# EAGLE design tactBell_revA (EAGLE 8.4.0)
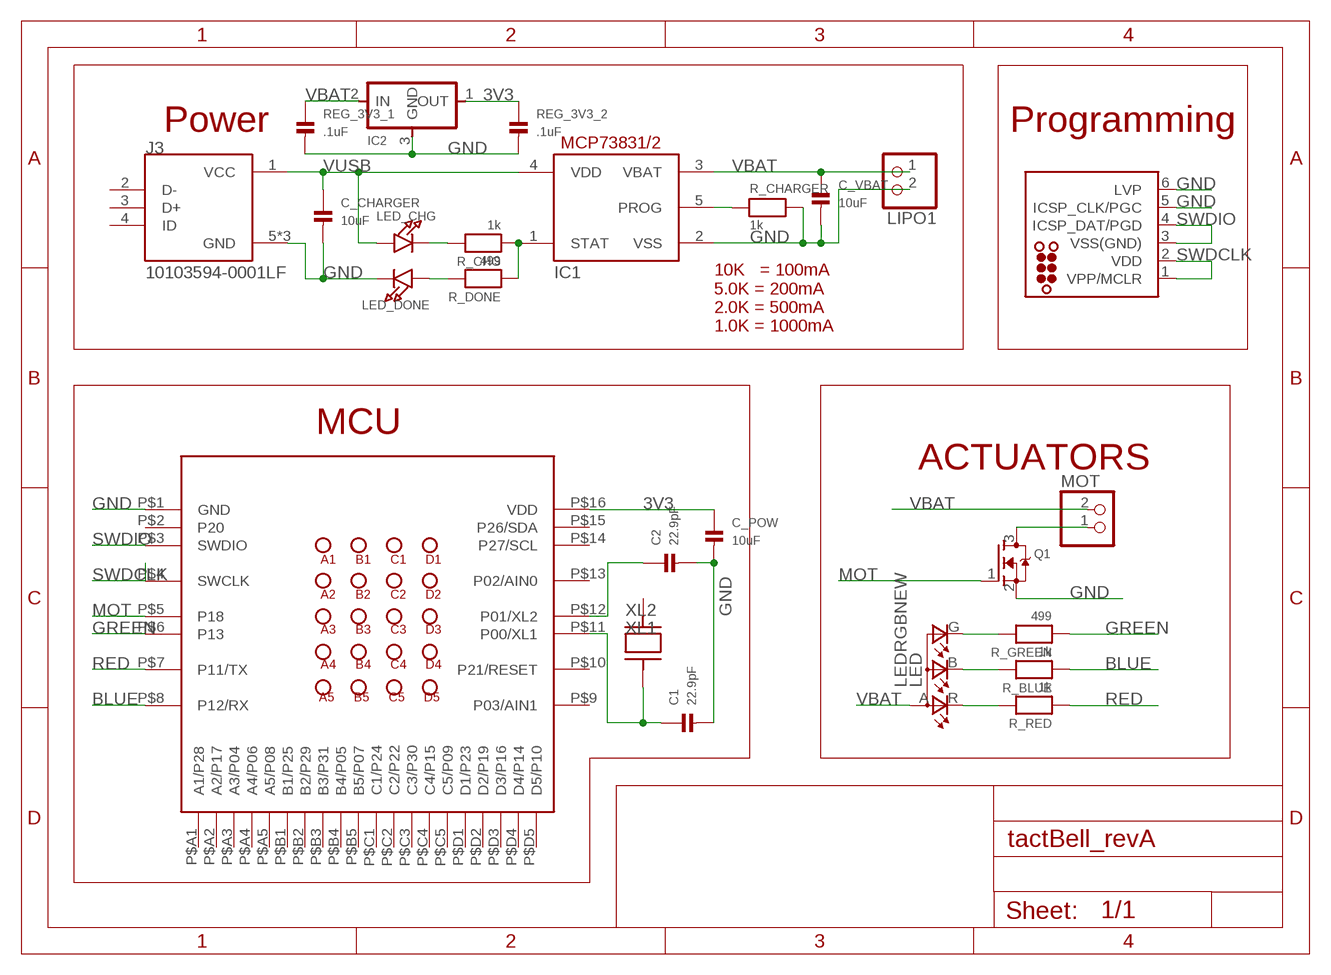
[diagram p0: schematic, sheet 1]

## Parts
C1  22.9pF  CAP_CERAMIC0603  [0603]
C2  22.9pF  CAP_CERAMIC0603  [0603]
C_CHARGER  10uF  CAP_CERAMIC0603  [0603]
C_POW  10uF  CAP_CERAMIC0603  [0603]
C_VBAT  10uF  CAP_CERAMIC0603  [0603]
IC1  MCP73831/OT  [SOT23-5L]
IC2  REGULATORSOT23  [SOT23]
J1  TC2030-MCP-NL  [TC2030-MCP-NL]
J3  10103594-0001LF  [FCI_10103594-0001LF]
LED  LEDRGBNEW  [P-LCC-4]
LED_CHG  LED0603  [CHIPLED_0603]
LED_DONE  LED0603  [CHIPLED_0603]
LIPO1  JST_2PIN-SMT-RA  [JST-PH-2-SMT-RA]
MOT  JST_2PIN-SMT-RA  [JST-PH-2-SMT-RA]
Q1  MOSFET-NREFLOW  [SOT23-R]
R_BLUE  1k  RESISTOR0603  [0603]
R_CHARGER  1k  RESISTOR0603  [0603]
R_CHG  1k  RESISTOR0603  [0603]
R_DONE  499  RESISTOR0603  [0603]
R_GREEN  499  RESISTOR0603  [0603]
R_RED  1k  RESISTOR0603  [0603]
REG_3V3_1  .1uF  CAP_CERAMIC0603  [0603]
REG_3V3_2  .1uF  CAP_CERAMIC0603  [0603]
U2  BC832-V0  [BC832]
XL  ECX-31B  [ECX-31B]

## Nets
3V3: C_POW.1 IC2.1(OUT) REG_3V3_2.1 U2.P$16(VDD)
B: LED.B(CBLUE) R_BLUE.2
BLUE: R_BLUE.1 U2.P$8(P12/RX)
G: LED.G(CGREEN) R_GREEN.2
GND: C1.2 C2.2 C_CHARGER.2 C_POW.2 C_VBAT.2 IC1.2(VSS) IC2.3(GND) J1.5(ICSP_CLK/PGC) J1.6(LVP) J3.5(GND) J3.P3(GND) J3.P4(GND) LED_DONE.C LIPO1.2 Q1.2(S) R_CHARGER.2 REG_3V3_1.2 REG_3V3_2.2 U2.P$1(GND)
GREEN: R_GREEN.1 U2.P$6(P13)
MOT: Q1.1(G) U2.P$5(P18)
N$1: LED_DONE.A R_DONE.2
N$2: MOT.1 Q1.3(D)
N$3: LED_CHG.C R_CHG.2
PROG: IC1.5(PROG) R_CHARGER.1
R: LED.R(CRED) R_RED.2
RED: R_RED.1 U2.P$7(P11/TX)
STAT: IC1.1(STAT) R_CHG.1 R_DONE.1
SWDCLK: J1.1(VPP/MCLR) J1.2(VDD) U2.P$4(SWCLK)
SWDIO: J1.3(VSS(GND)) J1.4(ICSP_DAT/PGD) U2.P$3(SWDIO)
VBAT: C_VBAT.1 IC1.3(VBAT) IC2.2(IN) LED.A(A2) LIPO1.1 MOT.2 REG_3V3_1.1
VUSB: C_CHARGER.1 IC1.4(VDD) J3.1(VCC) LED_CHG.A
XL1: C1.1 U2.P$11(P00/XL1) XL.XL1
XL2: C2.1 U2.P$12(P01/XL2)
Unconnected: J3.2(D-) J3.3(D+) J3.4(ID) U2.P$2(P20) U2.P$9(P03/AIN1) U2.P$10(P21/RESET) U2.P$13(P02/AIN0) U2.P$14(P27/SCL) U2.P$15(P26/SDA) U2.P$A1(A1/P28) U2.P$A2(A2/P17) U2.P$A3(A3/P04) U2.P$A4(A4/P06) U2.P$A5(A5/P08) U2.P$B1(B1/P25) U2.P$B2(B2/P29) U2.P$B3(B3/P31) U2.P$B4(B4/P05) U2.P$B5(B5/P07) U2.P$C1(C1/P24) U2.P$C2(C2/P22) U2.P$C3(C3/P30) U2.P$C4(C4/P15) U2.P$C5(C5/P09) U2.P$D1(D1/P23) U2.P$D2(D2/P19) U2.P$D3(D3/P16) U2.P$D4(D4/P14) U2.P$D5(D5/P10) XL.XL2

## Notes on the sheet
- Power | Programming
- 10K   = 100mA
  5.0K = 200mA
  2.0K = 500mA
  1.0K = 1000mA
- MCU
- ACTUATORS

## Library data of the parts
C1 C2 C_CHARGER C_POW C_VBAT REG_3V3_1 REG_3V3_2 = microbuilder:CAP_CERAMIC: Ceramic Capacitors 0402 - 0402 Surface Mount Capacitors 16pF 50V 5% [Digikey: 445-4899-2-ND] 18pF 50V 5% [Digikey: 490-1281-2-ND] 22pF 50V 5% [Digikey: 490-1283-2-ND] 68pF 50V 5% [Digikey: 490-1289-2-ND] 0.1uF 10V 10% [Digikey: 490-1318-2-ND] 1.0uF 6.3V 10% [Digikey: 490-1320-2-ND] 0603 - 0603 Surface Mount Capacitors 16 pF 50V 5% [Digikey: 445-5051-2-ND] 22 pF 50V [Digikey: PCC220ACVTR-ND] 33 pF 50V 5% [Digikey: 490-1415-1-ND] 56pF 50V 5% [Digikey: 490-1421-1-ND] 220pF 50V 5% [Digikey: 445-1285-1-ND] 680 pF 50V 2200 pF 50V 5% C0G [Digikey: 445-1297-1-ND] 5600 pF 100V 5% X7R [Digikey: 478-3711-1-ND] 0.1 µF 25V 10% [Digikey: PCC2277TR-ND] 0.22 µF 16V 10% X7R [Digikey: 445-1318-1-ND] 1.0 µF 25V 10% [Digikey: 445-5146-2-ND] 0603 - RF Specific 3pF 250V +/-0.1pF RF [Digikey: 712-1347-1-ND] 18 pF 250V 5% [Digikey: 478-3505-1-ND or 712-1322-1-ND] 56 pF 250V 5% C0G RF [Digikey: 490-4867-1-ND] 68 pF 250V RF [Digikey: 490-4868-1-ND] 0805 - 0805 Surface Mount Capacitors 220 pF 250V 2% RF Ceramic Capacitor [Digikey: 712-1398-1-ND] 1000 pF 50V 2% NP0 Ceramic Capacitor [Digikey: 478-3760-1-ND] 0.1 µF 25V 10% Ceramic Capacitor [Digikey: PCC1828TR-ND] 1.0 µF 16V 10% Ceramic Capacitor[Digikey: 490-1691-2-ND] 10.0 µF 10V 10% Ceramic Capacitor[Digikey: 709-1228-1-ND] 10.0 uF 16V 10% Ceramic Capacitor [Digikey: 478-5165-2-ND] 47 uF 6.3V 20% Ceramic Capacitor [Digikey: 587-1779-1-ND or 399-5506-1-ND] 1206 - 1206 Surface Mount Capacitors 47uF 10V 20% Ceramic Capacitor [Digikey: 490-5528-1-ND or 399-5508-1-ND or 445-6010-1-ND] 100uF 6.3V -20%, +80% Y5V Ceramic Capacitor (Digikey: 490-4512-1-ND, Mouser: 81-GRM31CF50J107ZE1L)
IC1 = adafruit:MCP73831: MCP73831/2 Miniature Single-Cell, Fully Integrated Li-Ion, Li-Polymer Charge Management Controllers. Nice and small simple lipoly charge controller, with adjustable current and status output (LED) http://www.ladyada.net/library/pcb/eaglelibrary.html
IC2 = fab:REGULATOR
J1 = tag-connect:TC2030: TAG-CONNECT ICSP Connector Manufacturer: Tag-Connect <http://www.tag-connect.com> Cable for easy In-Circuit Serial Programming. Designed for Microchip ICD2, suitable for many others. Two variants - one "with legs" (for hands-free fit on PCB) and another "without legs" for quick programming. PAD Description 1 MCLR/Vpp 2 Vdd 3 GND 4 PGD (ISPDAT) 5 PGC (ISPCLK) 6 nc (used for LVP) ©2009 ROFA.cz - modified and updated by Robert Darlington ‹rdarlington@gmail.com›
J3 = 10103594-0001LF:10103594-0001LF: Conn Micro USB Type B RCP 5 POS 0.65mm Solder RA SMD 5 Terminal 1 Port T/R; AVAILABILITY: Good; DESCRIPTION: Conn Micro USB Type B RCP 5 POS 0.65mm Solder RA SMD 5 Terminal 1 Port T/R; MF: FCI; MP: 10103594-0001LF; PACKAGE: None; PRICE: 0.40 USD
LED = fab:LEDRGBNEW
LED_CHG LED_DONE = microbuilder:LED: LED 0603 - 0603 Surface Mount Package 2mA: Green LED - Low Power (3.9mcd, 2ma, 1.7Vf) - Digikey: 475-2709-2-ND Orange LED - Low Power (9.8mcd, 2ma, 1.8Vf) - Digikey: 475-1194-2-ND Red LED - Low Power (5mcd, 2ma, 1.8Vf) - Digikey: 475-1195-2-ND Yellow LED - Low Power (7mcd, 2ma, 1.8Vf) - Digikey: 475-1196-2-ND 5mA: Blue LED - Low Power (17mcd, 5ma, 2.9Vf) - Digikey: LNJ937W8CRACT-ND 0805 - 0805 Surface Mount Package 2mA: Red LED (8.8mcd, 2mA, 1.8Vf, Clear) - Low Power [Digikey: 475-2510-1-ND] Green LED (5mcd, 2mA, 1.8Vf, Clear) - Low Power [Digikey: 475-2730-1-ND] Yellow LED (11.3mcd, 2mA, 1.8Vf, Clear) - Low Power [Digikey: 475-2555-1-ND] 20mA: Red LED (104mcd, 20mA, Diffused) - LS R976 [Digikey: 475-1278-6-ND] Red LED (12mcd, 20mA, 2.0Vf, Clear) - APT2012EC [Digikey: 754-1128-1-ND] Green LED (15mcd, 20mA, 2.2Vf, Clear) - APT2012GC [Digikey: 754-1131-1-ND] Orange LED (160mcd, 20mA, 2.1Vf, Clear) - APT2012SECK [Digikey: 754-1130-1-ND] 1206 - 1206 Surface Mount Package Green LED (26mcd, 20mA, Diffused) - LG N971 [Digikey: 475-1407-6-ND] Red LED (15mcd, 20mA, Diffused) - LH N974 [Digikey: 475-1416-6-ND]
LIPO1 MOT = adafruit:JST_2PIN: JST 2-Pin Connectors of various flavors SMT-RA (S2B-PH-SM4) 4UConnector #17311 SMT (B2B-PH-SM4) THM-RA (S2B-PH) THM (B2B-PH)
Q1 = microbuilder:MOSFET-N: N-Channel Mosfet LEGEND VDS: Voltage Drain-Source ID: Drain Current RDS(ON): Drain-Source On-State Resistance VGS(TH): Gate-Source Threshold Voltage CISS: Drain-Source Input Capacitance SOT-23 Name VDS ID RDS(ON) VGS(TH) CISS Order Number 2N7002E 60V 260mA 2.5 Ohm 2.5V @ 250uA 26.7pF @ 25V 2N7002ET1GOSTR-ND BSH103 30V 850mA 400 mOhm 400mV @ 1mA 83pF @ 24V BSH103,235-ND BSS138 60V 320mA 1.6 Ohm 1.5V @ 250uA 50pF @ 10V Mouser: 771-BSS138PW115 DMN2075U-7 20V 4.2A 38 mOhm 1V @ 250 uA 594.3pF @ 10V DMN2075U-7DICT-ND * BSS138 good choice for I2C level-shifting
R_BLUE R_CHARGER R_CHG R_DONE R_GREEN R_RED = microbuilder:RESISTOR: Resistors 0402 - 0402 Surface Mount Package 22 Ohm 1% 1/16W [Digikey: 311-22.0LRTR-ND] 33 Ohm 5% 1/16W 1.0K 5% 1/16W 1.5K 5% 1/16W 2.0K 1% 1/16W 10.0K 1% 1/16W [Digikey: 311-10.0KLRTR-ND] 10.0K 5% 1/16W [Digikey: RMCF0402JT10K0TR-ND] 12.1K 1% 1/16W [Digikey: 311-22.0LRTR-ND] 100.0K 5% 1/16W 0603 - 0603 Surface Mount Package 0 Ohm 1/10 Watt 1% Resistor 15 Ohm 1/10 Watt 1% Resistor 33 Ohm 1/10 Watt 1% Resistor 49.9 Ohm 1/10 Watt 1% Resistor 100 Ohm 1/10 Watt 1% Resistor 150 Ohm 1/10 Watt 1% Resistor 240 Ohm 1/10 Watt 1% Resistor 390 Ohm 1/10 Watt 1% Resistor 560 Ohm 1/10 Watt 1% Resistor 680 Ohm 1/10 Watt 1% Resistor 750 Ohm 1/10 Watt 1% Resistor 1.0K Ohm 1/10 Watt 1% Resistor 1.5K Ohm 1/10 Watt 1% Resistor 2.0K Ohm 1/10 Watt 1% Resistor 2.2K Ohm 1/10 Watt 1% Resistor 3.3K Ohm 1/10 Watt 1% Resistor 4.7K Ohm 1/10 Watt 1% Resistor 10.0K Ohm 1/10 Watt 1% Resistor 12.0K Ohm 1/10 Watt 1% Resistor 12.1K Ohm 1/10 Watt 1% Resistor 20.0K Ohm 1/10 Watt 1% Resistor 33.0K Ohm 1/10 Watt 1% Resistor 100.0K Ohm 1/10 Watt 1% Resistor 0805 - 0805 Surface Mount Package 0 Ohm 1/8 Watt 1% Resistor 33 Ohm 1/8 Watt 1% Resistor 100 Ohm 1/8 Watt 1% Resistor 150 Ohm 1/8 Watt 1% Resistor 200 Ohm 1/8 Watt 1% Resistor 240 Ohm 1/8 Watt 1% Resistor 330 Ohm 1/8 Watt 1% Resistor 390 Ohm 1/8 Watt 1% Resistor 470 Ohm 1/8 Watt 1% Resistor 1.0K Ohm 1/8 Watt 1% Resistor 1.5K Ohm 1/8 Watt 1% Resistor 2.0K Ohm 1/8 Watt 1% Resistor 4.7K Ohm 1/8 Watt 1% Resistor 5.1K Ohm 1/8 Watt 1% Resistor 5.6K Ohm 1/8 Watt 1% Resistor 10.0K Ohm 1/8 Watt 1% Resistor 22.0K Ohm 1/8 Watt 1% Resistor 33.0K Ohm 1/8 Watt 1% Resistor 100K Ohm 1/8 Watt 1% Resistor 1206 - 1206 Surface Mount Package 2012 - 2010 Surface Mount Package 0.11 Ohm 1/2 Watt 1% Resistor - Digikey: RHM.11UCT-ND
U2 = BC832:BC832-V0
XL = myParts:ECX-31B

## Board
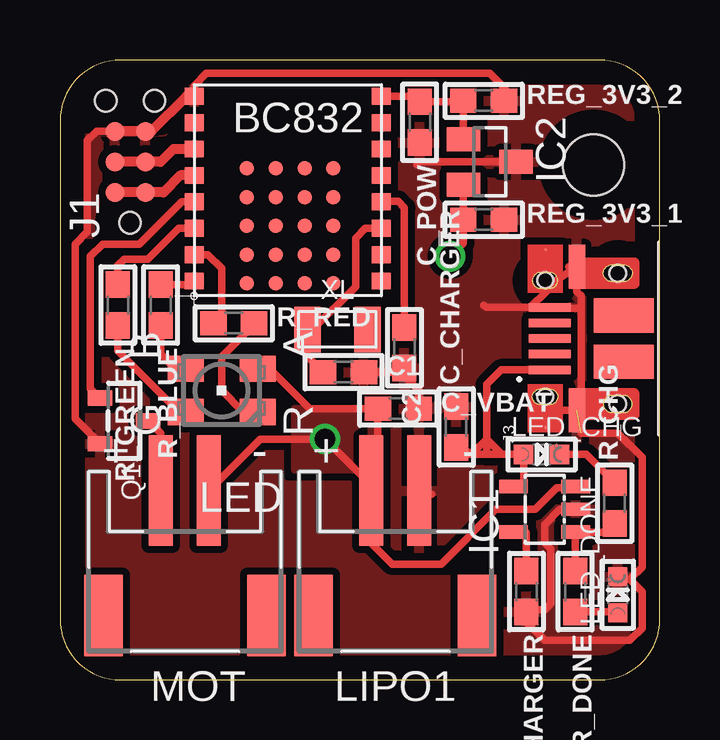
[diagram p1: board, top side]
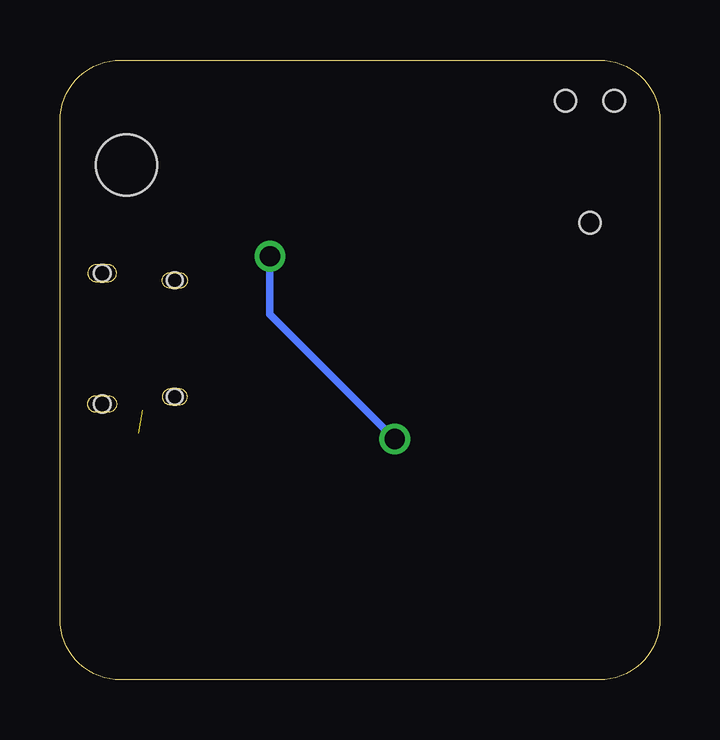
[diagram p2: board, bottom side, seen from below]

Size 25 x 25.83 mm. Coordinates in mm from the lower left corner, seen from the top.
Outline: 22.46,25.83 2.54,25.83 arc90 0,23.29 0,2.54 arc90 2.54,0 22.46,0 arc90 25,2.54 25,23.29 arc90 22.46,25.83
Copper layers (1*16): Top 0.035mm / dielectric 1.5mm / Bottom 0.035mm
Design rules "default *": minimum track width 6mil, minimum drill 0.35mm, track to track 10mil, track to pad 10mil, pad to pad 10mil, via to via 10mil, smd to smd 10mil, copper to edge 40mil, drill to drill 6mil, minimum pad ring 10mil, minimum via ring 8mil, stop-mask expansion 4mil, vias tented up to drill 0mil, thermal gap 10mil
Holes 2.54 mm at 22.22,21.46
tRestrict: area 6.5,16.1 to 12.6,24.6

### Footprints (pad centres in the part's own frame; a part is rotated, then mirrored left to right if it is on the bottom)
0603 = smd 1.1 x 1: 1 -0.85,0; 2 0.85,0
SOT23-5L = smd 0.55 x 1.2: 1 -0.95,-1.3; 2 0,-1.3; 3 0.95,-1.3; 4 0.95,1.3; 5 -0.95,1.3
SOT23 = smd 1 x 1.4: 1 -0.95,-1.1; 2 0.95,-1.1; 3 0,1.1
TC2030-MCP-NL = smd 0.787 x 0.787: 1 1.27,-0.635; 2 1.27,0.635; 3 2.54,-0.635; 4 2.54,0.635; 5 3.81,-0.635; 6 3.81,0.635 | hole 0.889: 0,0; 5.08,-1.016; 5.08,1.016
FCI_10103594-0001LF = smd 0.356 x 1.75: 1 -1.3,2.825; 2 -0.65,2.825; 3 0,2.825; 4 0.65,2.825; 5 1.3,2.825 | smd 0.1 x 0.1: P1 -3.7,3; P2 3.7,3 | smd 1.825 x 0.7: P3 -2.987,1.7; P4 2.987,1.7 | smd 1.425 x 2.5: P5 -0.963,-0.25; P6 0.963,-0.25 | hole 0.7: -2.725,0; 2.725,0 | hole 0.65: -2.425,3.03; 2.425,3.03
P-LCC-4 = smd 1.1 x 1.5: A 0.902,-1.5; B 0.902,1.5; G -0.902,1.5; R -0.902,-1.5
CHIPLED_0603 = smd 0.8 x 0.8: A 0,-0.75; C 0,0.75
JST-PH-2-SMT-RA = smd 1 x 4.6: 1 1,-3.7; 2 -1,-3.7 | smd 1.6 x 3.4: NC1 -3.4,1.5; NC2 3.4,1.5
SOT23-R = smd 0.635 x 1.016: 1 -0.95,-1; 2 0.95,-1; 3 0,1
BC832 = smd 0.8 x 0.7: P$1 0,8.32; P$2 0,7.22; P$3 0,6.12; P$4 0,5.02; P$5 0,3.92; P$6 0,2.82; P$7 0,1.72; P$8 0,0.62; P$9 7.8,0.62; P$10 7.8,1.72; P$11 7.8,2.82; P$12 7.8,3.92; P$13 7.8,5.02; P$14 7.8,6.12; P$15 7.8,7.22; P$16 7.8,8.32 | smd 0.6 x 0.6: P$A1 2.2,5.319; P$A2 2.2,4.119; P$A3 2.2,2.919; P$A4 2.2,1.719; P$A5 2.2,0.519; P$B1 3.4,5.319; P$B2 3.4,4.119; P$B3 3.4,2.919; P$B4 3.4,1.719; P$B5 3.4,0.519; P$C1 4.6,5.319; P$C2 4.6,4.119; P$C3 4.6,2.919; P$C4 4.6,1.719; P$C5 4.6,0.519; P$D1 5.8,5.319; P$D2 5.8,4.119; P$D3 5.8,2.919; P$D4 5.8,1.719; P$D5 5.8,0.519
ECX-31B = smd 1.1 x 1.9: XL1 -1.25,0; XL2 1.255,0

### Placement (x,y rotation side)
C1  11.81,12.83 0 top
C2  14.35,13.84 270 top
C_CHARGER  16.51,10.54 90 top
C_POW  14.99,23.24 270 top
C_VBAT  14.1,11.3 0 top
IC1  20.19,7.11 90 top
IC2  17.91,21.59 270 top
J1  2.92,19.05 90 top
J3  23.24,14.22 90 top
LED  6.73,12.06 90 top
LED_CHG  20.07,9.4 270 top
LED_DONE  23.24,3.56 0 top
LIPO1  13.97,4.19 180 top
MOT  5.21,4.19 180 top
Q1  2.67,10.79 270 top
R_BLUE  4.19,15.62 270 top
R_CHARGER  19.43,3.68 270 top
R_CHG  23.11,7.37 90 top
R_DONE  21.46,3.68 270 top
R_GREEN  2.41,15.62 270 top
R_RED  7.24,14.86 0 top
REG_3V3_1  17.65,19.18 0 top
REG_3V3_2  17.65,24.13 0 top
U2  5.59,16 0 top
XL  11.56,14.61 0 top

### Tracks (layer width: path | path; a pad name or v marks a point on that pad's centre or on a via)
3V3
  Top 0.305: U2.P$16 14.75,24.32 C_POW.1 16.76,24.09 REG_3V3_2.1 IC2.1
B
  Top 0.305: R_BLUE.2 4.19,13.59 4.56,13.22 LED.B
BLUE
  Top 0.305: U2.P$8 5.44,16.47 R_BLUE.1
G
  Top 0.305: LED.G 4.97,11.16 2.41,13.72 R_GREEN.2
GND  (1 unrouted)
  Top 0.305: 15.49,7.75 LIPO1.2 | 14.18,12.83 C1.2 | 14.18,12.83 C2.2 | C_VBAT.2 14.95,12.06 14.18,12.83 | 17.65,15.62 17.75,15.52 J3.5 | 20.27,16.38 20.27,16.21 19.59,15.52 J3.5 | 20.27,16.38 J3.P4 | IC2.3 14.99,21.59 14.86,21.46 | J1.6 1.52,22.86 1.14,22.48 1.14,18.67 0.64,18.16 0.64,10.88 Q1.2 | IC1.2 20.83,7.11 20.19,6.48 20.19,5.71 20.45,5.46 20.45,3.17 20.19,2.92 19.52,2.92 R_CHARGER.2 19.43,2.41 20.19,1.65 23.75,1.65 24.26,2.16 24.26,3.68 23.75,4.19 | LED_DONE.C 23.36,4.19 23.75,4.19 | J3.P3 20.77,11.24 | 23.75,4.19 24.26,4.7 24.26,9.27 23.24,10.29 21.72,10.29 | 20.27,16.38 20.45,16.38 | 20.27,11.25 J3.P3 | 21.19,17.21 J3.P4 | U2.P$1 5.59,24.77 6.1,25.27 17.91,25.27 18.54,24.64 18.54,24.17 REG_3V3_2.2 | J3.P3 21.72,11.41 | J3.P4 21.54,16.18 21.72,16 21.72,15.49 | 21.72,15.49 21.72,11.41 | 21.72,11.41 J3.P3 | J3.5 20.45,15.49 21.72,15.49
  Top 0.406: J1.6 J1.5 3.81,22.86 5.27,24.32 U2.P$1
  pour Top (isolate 0.305, rank 2): -0.38,27.81 26.29,27.81 26.29,-1.4 -0.38,-1.4
GREEN
  Top 0.305: U2.P$6 4.95,18.82 3.66,17.53 2.67,17.53 2.41,17.27 R_GREEN.1
MOT
  Top 0.305: U2.P$5 5.06,19.92 3.3,18.16 1.78,18.16 1.27,17.65 1.27,12.14 Q1.1
N$1
  Top 0.305: R_DONE.2 23.21,2.83 LED_DONE.A
N$2
  Top 0.305: Q1.3 4.19,10.27 4.19,9.78 4.21,9.76 MOT.1
N$3
  Top 0.305: R_CHG.2 21.93,9.4 LED_CHG.C
PROG
  Top 0.305: IC1.5 19.43,6.13 R_CHARGER.1
R
  Top 0.305: R_RED.2 8.09,14.82 6.73,13.46 6.73,12.06 7.62,11.18 8.22,11.18 LED.R
RED
  Top 0.305: R_RED.1 6.73,15.2 6.73,17.14 6.15,17.72 U2.P$7
STAT
  Top 0.305: R_DONE.1 21.46,5.62 IC1.1 22.76,6.16 R_CHG.1
SWDCLK
  Top 0.406: U2.P$4 5.02,21.02 4.32,20.32 J1.1 J1.2
SWDIO
  Top 0.406: J1.4 J1.3 4.19,21.59 4.72,22.12 U2.P$3
VBAT  (via drill 0.85)
  Top 0.305: C_VBAT.1 10.41,11.3 8.76,12.95 8.24,12.95 LED.A | 13.35,11.2 C_VBAT.1 | 13.08,8 LIPO1.1 12.95,7.88 12.95,5.71 13.84,4.83 15.88,4.83 18.16,7.11 19.81,7.11 20.7,8 21.94,8 IC1.3 | 13.08,8 13.25,8.17 C_VBAT.1 | IC2.2 REG_3V3_1.1 16.8,18.2 v16.26,17.65 | 13.08,8 v11.05,10.03 8.35,10.03 MOT.2
  Bottom 0.305: v16.26,17.65 16.26,15.24 v11.05,10.03
  pour Top: 9.78,11.3 9.78,8.76 13.59,8.76 13.59,11.3
VUSB
  Top 0.305: LED_CHG.A 19.32,8.15 IC1.4 | 17.78,9.4 LED_CHG.A | 17.78,9.4 17.06,9.4 16.72,9.48 | 16.72,9.48 C_CHARGER.1 | J3.1 18.38,12.92 17.78,12.32 17.78,10.03 | 17.78,10.03 17.23,9.48 16.72,9.48 | LED_CHG.A 18.41,9.4 17.78,10.03 | 17.78,10.03 17.78,9.4
XL1
  Top 0.305: U2.P$11 12.73,18.82 12.32,18.41 12.32,16.38 10.54,14.61 XL.XL1 | 10.31,14.62 XL.XL1 | XL.XL1 10.31,13.48 C1.1
XL2
  Top 0.305: U2.P$12 13.4,19.94 14.1,19.94 14.35,19.68 C2.1